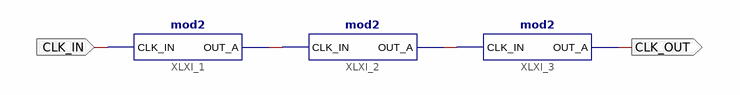
[diagram p0: schematic sheet 1]
// Xilinx ISE schematic mod8.sch (spartan6) as structural Verilog: 3 symbols, 2 ports
module mod8 (
  input  CLK_IN,
  output CLK_OUT
);

  wire XLXN_1, XLXN_2;

  mod2 XLXI_1 (.CLK_IN(CLK_IN), .OUT_A(XLXN_1));
  mod2 XLXI_2 (.CLK_IN(XLXN_1), .OUT_A(XLXN_2));
  mod2 XLXI_3 (.CLK_IN(XLXN_2), .OUT_A(CLK_OUT));
endmodule
